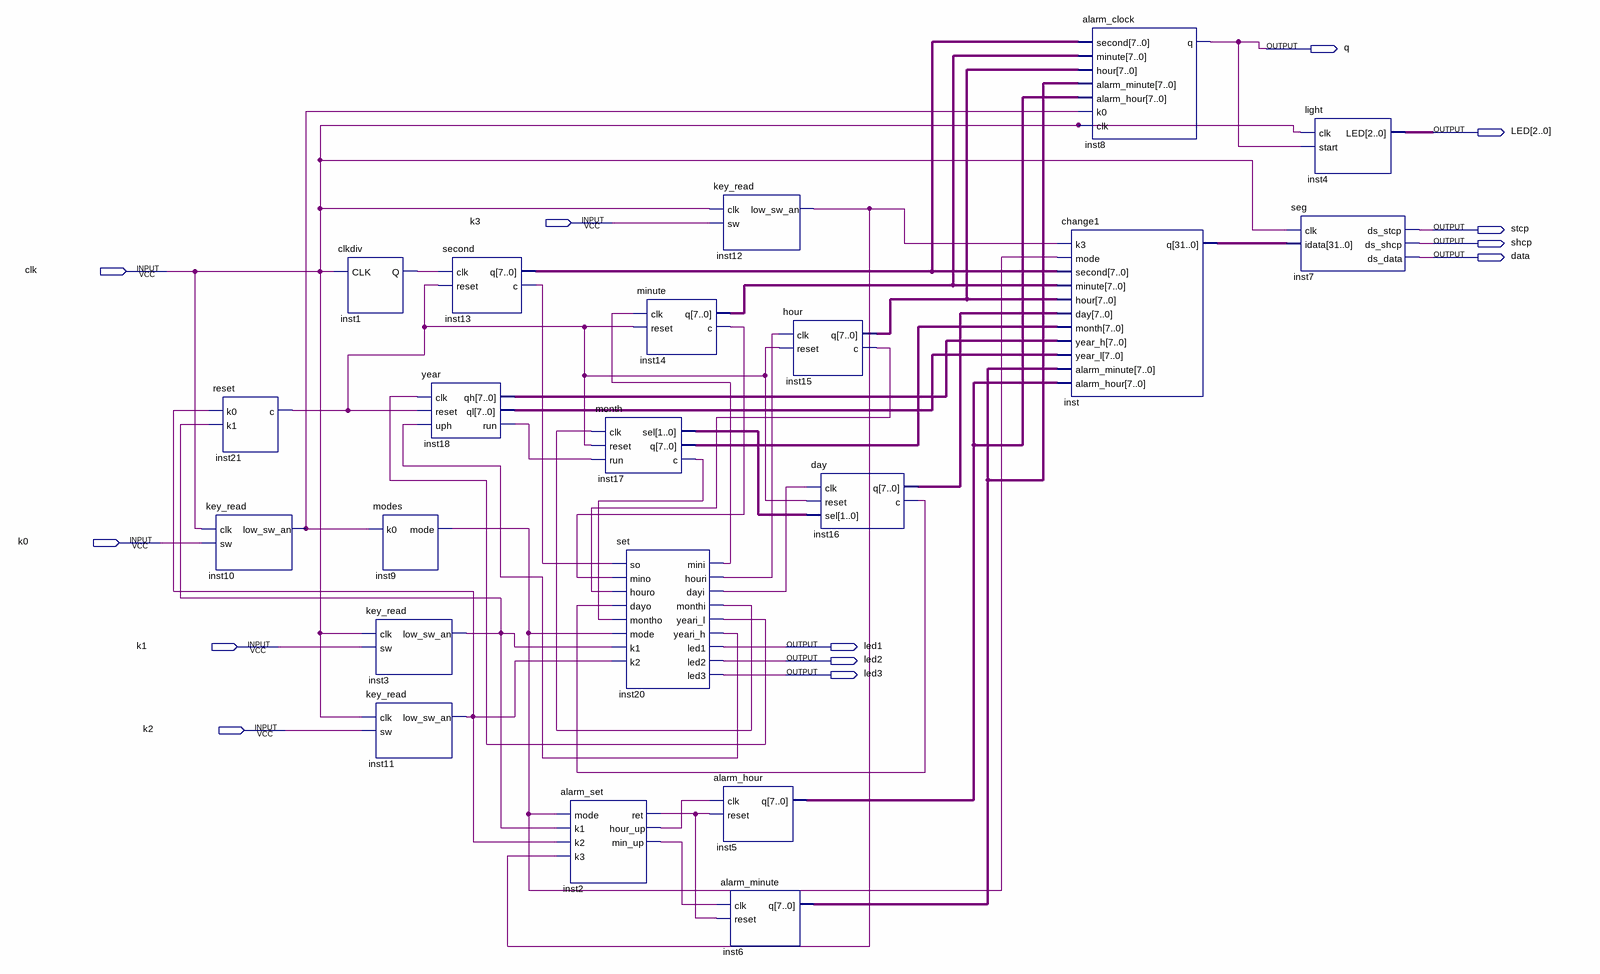
[diagram p0: schematic sheet]
// Quartus schematic Block1.bdf as structural Verilog: 21 symbols, 13 pins
module Block1 (
  input  k3,
  input  clk,
  input  k0,
  input  k1,
  input  k2,
  output q,
  output [2:0] LED,
  output stcp,
  output shcp,
  output data,
  output led1,
  output led2,
  output led3
);

  wire inst1_q, inst2_hour_up, inst2_min_up, inst2_ret, inst3_low_sw_an, inst9_mode, inst10_low_sw_an,
       inst11_low_sw_an, inst12_low_sw_an, inst13_c, inst14_c, inst15_c, inst16_c, inst17_c, inst18_run,
       inst20_dayi, inst20_houri, inst20_mini, inst20_monthi, inst20_yeari_h, inst20_yeari_l, inst21_c;
  wire [1:0] inst17_sel;
  wire [7:0] inst5_q, inst6_q, inst13_q, inst14_q, inst15_q, inst16_q, inst17_q, inst18_qh, inst18_ql;
  wire [31:0] inst_q;

  reset inst21 (.k0(inst11_low_sw_an), .k1(inst3_low_sw_an), .c(inst21_c));
  key_read inst10 (.clk(clk), .sw(k0), .low_sw_an(inst10_low_sw_an));
  clkdiv inst1 (.CLK(clk), .Q(inst1_q));
  modes inst9 (.k0(inst10_low_sw_an), .mode(inst9_mode));
  key_read inst3 (.clk(clk), .sw(k1), .low_sw_an(inst3_low_sw_an));
  key_read inst11 (.clk(clk), .sw(k2), .low_sw_an(inst11_low_sw_an));
  second inst13 (.clk(inst1_q), .reset(inst21_c), .q(inst13_q), .c(inst13_c));
  year inst18 (
    .clk(inst20_yeari_l), .reset(inst21_c), .uph(inst20_yeari_h), .qh(inst18_qh), .ql(inst18_ql),
    .run(inst18_run));
  alarm_set inst2 (
    .mode(inst9_mode), .k1(inst3_low_sw_an), .k2(inst11_low_sw_an), .k3(inst12_low_sw_an), .ret(inst2_ret),
    .hour_up(inst2_hour_up), .min_up(inst2_min_up));
  minute inst14 (.clk(inst20_mini), .reset(inst21_c), .q(inst14_q), .c(inst14_c));
  month inst17 (.clk(inst20_monthi), .reset(inst21_c), .run(inst18_run), .sel(inst17_sel), .q(inst17_q), .c(inst17_c));
  set inst20 (
    .so(inst13_c), .mino(inst14_c), .houro(inst15_c), .dayo(inst16_c), .montho(inst17_c), .mode(inst9_mode),
    .k1(inst3_low_sw_an), .k2(inst11_low_sw_an), .mini(inst20_mini), .houri(inst20_houri),
    .dayi(inst20_dayi), .monthi(inst20_monthi), .yeari_l(inst20_yeari_l), .yeari_h(inst20_yeari_h),
    .led1(LED[1]), .led2(LED[2]), .led3(led3));
  key_read inst12 (.clk(clk), .sw(k3), .low_sw_an(inst12_low_sw_an));
  alarm_hour inst5 (.clk(inst2_hour_up), .reset(inst2_ret), .q(inst5_q));
  alarm_minute inst6 (.clk(inst2_min_up), .reset(inst2_ret), .q(inst6_q));
  hour inst15 (.clk(inst20_houri), .reset(inst21_c), .q(inst15_q), .c(inst15_c));
  day inst16 (.clk(inst20_dayi), .reset(inst21_c), .sel(inst17_sel), .q(inst16_q), .c(inst16_c));
  alarm_clock inst8 (
    .second(inst13_q), .minute(inst14_q), .hour(inst15_q), .alarm_minute(inst6_q), .alarm_hour(inst5_q),
    .k0(inst10_low_sw_an), .clk(clk), .q(q));
  change1 inst (
    .k3(inst12_low_sw_an), .mode(inst9_mode), .second(inst13_q), .minute(inst14_q), .hour(inst15_q),
    .day(inst16_q), .month(inst17_q), .year_h(inst18_qh), .year_l(inst18_ql), .alarm_minute(inst6_q),
    .alarm_hour(inst5_q), .q(inst_q));
  light inst4 (.clk(clk), .start(q), .LED(LED));
  seg inst7 (.clk(clk), .idata(inst_q), .ds_stcp(stcp), .ds_shcp(shcp), .ds_data(data));

  assign led1 = LED[1];
  assign led2 = LED[2];
endmodule
